# Altium project DW3120.PrjPcb
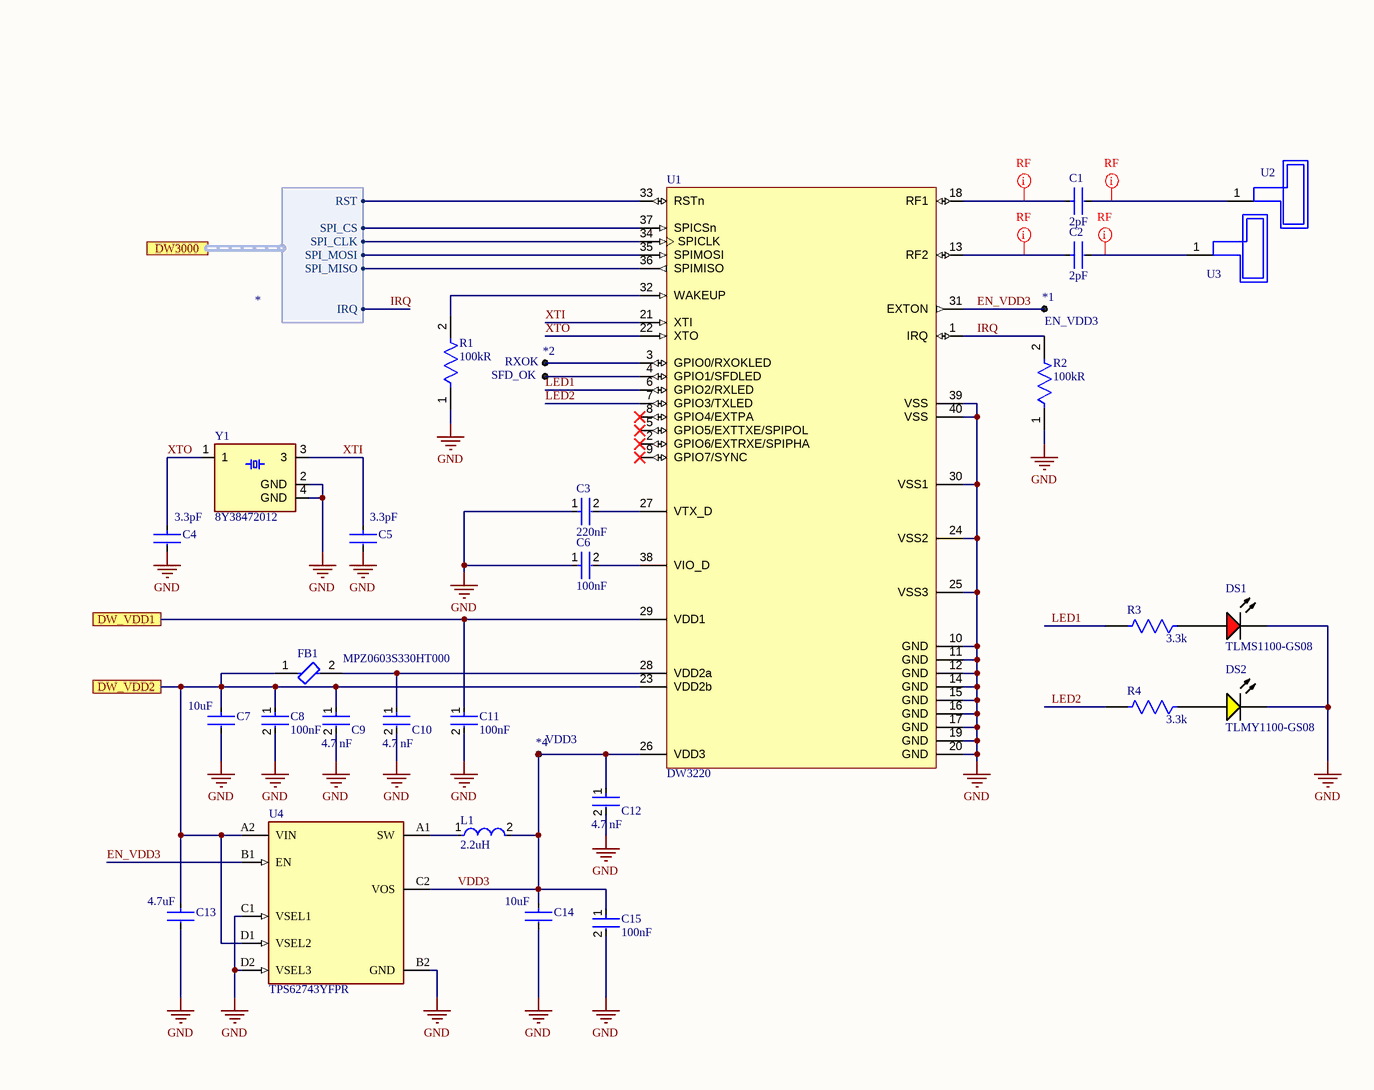
[diagram p0: DW3000.SchDoc]
2 sheets, 56 parts. Net scope: flat (ports and power ports of the same name join across sheets).
Board files: Deck.PcbDoc, PCB1_Layout_Final.PcbDoc
Sheets:
  DW3000.SchDoc
  Deck.SchDoc

## Sheet DW3000.SchDoc
size 254 x 203 mm

### Parts
*1  EN_VDD3  [Pad-0.6mm]  (no BOM)
*2  RXOK  [Pad-1mm]  (no BOM)
*3  SFD_OK  [Pad-1mm]  (no BOM)
*4  VDD3  [Pad-0.6mm]  (no BOM)
C1  Capacitance: 2pF  [FP-GJM033-0_03-IPC_B]  (hidden comment: GJM0335C1E2R0WB01D)
C2  Capacitance: 2pF  [FP-GJM033-0_03-IPC_B]  (hidden comment: GJM0335C1E2R0WB01D)
C3  Capacitance: 220nF  [FP-GRM155-0_05-IPC_C]  (hidden comment: GRM155R71C224KA12D)
C4  Capacitance: 3.3pF  [FP-GJM155-0_05-IPC_C]  (hidden comment: GJM1555C1H3R3BB01D)
C5  Capacitance: 3.3pF  [FP-GJM155-0_05-IPC_C]  (hidden comment: GJM1555C1H3R3BB01D)
C6  Capacitance: 100nF  [FP-GRM155-0_05-IPC_B]  (hidden comment: GRM155R71E104ME14D)
C7  Capacitance: 10uF  [FP-GRM155-0_2-0_1-IPC_C]  (hidden comment: GRM155R60J106ME47D)
C8  Capacitance: 100nF  [FP-GRM155-0_05-IPC_B]  (hidden comment: GRM155R71E104ME14D)
C9  Parameter 1: 4.7 nF  [FP-GRM155-0_15-IPC_B]  (hidden comment: GRM1555C1H472GE01D)
C10  Parameter 1: 4.7 nF  [FP-GRM155-0_15-IPC_B]  (hidden comment: GRM1555C1H472GE01D)
C11  Capacitance: 100nF  [FP-GRM155-0_05-IPC_B]  (hidden comment: GRM155R71E104ME14D)
C12  Parameter 1: 4.7 nF  [FP-GRM155-0_15-IPC_B]  (hidden comment: GRM1555C1H472GE01D)
C13  Capacitance: 4.7uF  [FP-GRM155-0_15-IPC_B]  (hidden comment: GRM155C80J475MEAAD)
C14  Capacitance: 10uF  [FP-GRM155-0_2-0_1-IPC_C]  (hidden comment: GRM155R60J106ME47D)
C15  Capacitance: 100nF  [FP-GRM155-0_05-IPC_B]  (hidden comment: GRM155R71E104ME14D)
DS1  TLMS1100-GS08  [VISH-TLMX1100_V]
DS2  TLMY1100-GS08  [VISH-TLMX1100-2_V]
FB1  MPZ0603S330HT000  [FP-MPZ0603-IPC_B]
L1  Inductance: 2.2uH  [FP-DFE201610C-IPC_C]  (hidden comment: 1285AS-H-2R2M=P2)
R1  Resistance: 100kR  [FP-CRCW0402-e3-IPC_C]  (hidden comment: CRCW0402100KFKED)
R2  Resistance: 100kR  [FP-CRCW0402-e3-IPC_C]  (hidden comment: CRCW0402100KFKED)
R3  Resistance: 3.3k  [FP-CRCW0402-e3-IPC_C]
R4  Resistance: 3.3k  [FP-CRCW0402-e3-IPC_C]
U1  DW3220  [QFN40P500X500X40_HS-40N]
U2  AH086M555003-T  [AH086M]  (value not drawn)
U3  AH086M555003-T  [AH086M]  (value not drawn)
U4  TPS62743YFPR  [FP-YFP0008-C01-MFG]
Y1  8Y38472012  [OSCSC320X250X100N]

### Ports
DW3000 (harness *), DW_VDD1, DW_VDD2

### Harnesses
*: SPI_CS, SPI_CLK, SPI_MOSI, SPI_MISO, RST, IRQ

### Nets
GND: C3.1 C4.2 C5.2 C6.1 C7.2 C8.2 C9.2 C10.2 C11.2 C12.2 C13.2 C14.2 C15.2 DS1.2(K) DS2.2(K) R1.1 R2.1 U1.10(GND) U1.11(GND) U1.12(GND) U1.14(GND) U1.15(GND) U1.16(GND) U1.17(GND) U1.19(GND) U1.20(GND) U1.24(VSS2) U1.25(VSS3) U1.30(VSS1) U1.39(VSS) U1.40(VSS) U4.B2(GND) U4.C1(VSEL1) U4.D2(VSEL3) Y1.2(GND) Y1.4(GND)
CS: U1.37(SPICSn) ; port DW3000.SPI_CS
EN_VDD3: *1.1 U1.31(EXTON) U4.B1(EN)
IRQ: R2.2 U1.1(IRQ) ; port DW3000.IRQ
LED1: R3.2 U1.6(GPIO2/RXLED)
LED2: R4.2 U1.7(GPIO3/TXLED)
MISO: U1.36(SPIMISO) ; port DW3000.SPI_MISO
MOSI: U1.35(SPIMOSI) ; port DW3000.SPI_MOSI
RESET: U1.33(RSTn) ; port DW3000.RST
SCK: U1.34(SPICLK) ; port DW3000.SPI_CLK
VDD3: *4.1 C12.1 C14.1 C15.1 L1.2 U1.26(VDD3) U4.C2(VOS)
XTI: C5.1 U1.21(XTI) Y1.3
XTO: C4.1 U1.22(XTO) Y1.1
Net*2_1: *2.1 U1.3(GPIO0/RXOKLED)
Net*3_1: *3.1 U1.4(GPIO1/SFDLED)
NetC1_1: C1.1 U1.18(RF1)
NetC1_2: C1.2 U2.1
NetC2_1: C2.1 U1.13(RF2)
NetC2_2: C2.2 U3.1
NetC3_2: C3.2 U1.27(VTX_D)
NetC6_2: C6.2 U1.38(VIO_D)
NetC7_1: C7.1 C8.1 C9.1 C13.1 FB1.1 U1.23(VDD2b) U4.A2(VIN) U4.D1(VSEL2) ; port DW_VDD2
NetC10_1: C10.1 FB1.2 U1.28(VDD2a)
NetC11_1: C11.1 U1.29(VDD1) ; port DW_VDD1
NetDS1_1: DS1.1(A) R3.1
NetDS2_1: DS2.1(A) R4.1
NetL1_1: L1.1 U4.A1(SW)
NetR1_2: R1.2 U1.32(WAKEUP)

Not connected (* = marked no-connect by the designer): U1 2(GPIO6/EXTRXE/SPIPHA)* 5(GPIO5/EXTTXE/SPIPOL)* 8(GPIO4/EXTPA)* 9(GPIO7/SYNC)*

### Layout directives
net class RF: NetC1_1, NetC1_2, NetC2_1, NetC2_2

### Notes on the sheet
- 1
- 2
- 3
- 4
- A
- B
- C
- Project:
- D
- Date:
- Drawing number:
- Rev:
- Format:
- A4 Q
- Drawn by:
- Laboratory:
- Page
- Sheet:
- of
- File:

### Library data of the parts
*1 *4 = CMP-00224-1: 0.6mm SMT Test Pad; Mounting Technology: SMT
*2 *3 = CMP-01283-1: 1mm SMT Test Pad; Mounting Technology: SMT
C1 C2 = CMP-2010-00751-2: Ceramic Capacitor 2pF ±0.05pF 25V C0G 0201 (0603 Metric); Package Quantity: 15000; Min Operating Temperature: -55°C; Thickness: 0.013inch; Max Operating Temperature: 125°C; Voltage Rating: 25V; Voltage Rating (DC): 25V; Packaging: Tape and Reel; Width: 0.012inch; Length: 0.6mm; Height: 0.3mm; Mount: Surface Mount; Case Code (Imperial): 0201; Radiation Hardening: No; Dielectric: C0G; Termination: SMD/SMT; Case Code (Metric): 0603; Case/Package: 0201; Depth: 0.3mm
C3 = CMP-1034-02089-3: Chip Multilayer Ceramic Capacitors for General Purpose, 0402, 0.22uF, X7R, 15%, 10%, 16V; Depth: 0.5mm; Dielectric: X7R; Min Operating Temperature: -55°C; Package Quantity: 1; Termination: SMD/SMT; Mount: Surface Mount; Radiation Hardening: No; Height: 0.5mm; Case Code (Metric): 1005; Packaging: Tape and Reel; Material: Ceramic; Voltage: 16V; Voltage Rating (DC): 16V; REACH SVHC: No SVHC; Voltage Rating: 16V; Length: 1mm; Tolerance: 10%; Thickness: 0.022inch; Case Code (Imperial): 0402; Max Operating Temperature: 125°C; Width: 0.02inch; Lead Free: Lead Free; Case/Package: 0402
C4 C5 = CMP-2008-03846-2: Multi-Layer Ceramic Capacitor 3.3pF C0G  ±0.1pF 0402 Paper T/R; Voltage: 50V; Lead Free: Lead Free; Thickness: 0.022inch; Mount: Surface Mount; Termination: SMD/SMT; Package Quantity: 1; Lead Pitch: 0.3mm; Case/Package: 0402; REACH SVHC: No SVHC; Case Code (Imperial): 0402; Number of Pins: 2; Height: 0.5mm; Width: 0.5mm; Depth: 0.5mm; Packaging: Tape and Reel; Min Operating Temperature: -55°C; Length: 1mm; Dielectric: C0G; Case Code (Metric): 1005; Max Operating Temperature: 125°C; Voltage Rating (DC): 50V; Voltage Rating: 50V; Radiation Hardening: No
C6 C8 C11 C15 = CMP-06035-053616-1: Chip Multilayer Ceramic Capacitors for General Purpose, 0402, 0.10uF, X7R, 15%, 20%, 25V; Dielectric: X7R; Width: 0.5mm; Case/Package: 0402; Package Quantity: 10000; Lead Free: Lead Free; Voltage Rating (DC): 25V; Max Operating Temperature: 125°C; Depth: 0.5mm; Packaging: Tape and Reel; Length: 1mm; Case Code (Metric): 1005; Tolerance: 20%; Case Code (Imperial): 0402; Thickness: 0.022inch; Material: Ceramic; Voltage Rating: 25V; Weight: 0.000212oz; Min Operating Temperature: -55°C; Termination: SMD/SMT; Mount: Surface Mount; Resistor Type: Ceramic; Height: 0.5mm
C7 C14 = CMP-06035-022355-1: Chip Multilayer Ceramic Capacitors for General Purpose, 0402, 10uF, X5R, 15%, 20%, 6.3V; Mount: Surface Mount; Tolerance: 20%; Width: 0.02inch; Voltage Rating: 6.3V; Length: 0.039inch; Case Code (Imperial): 0402; Voltage Rating (DC): 6.3V; Max Operating Temperature: 85°C; Thickness: 0.024inch; Min Operating Temperature: -55°C; Packaging: Tape and Reel; Case/Package: 0402; Dielectric: X5R; Case Code (Metric): 1005
C9 C10 C12 = CMP-06035-019672-1: Chip Multilayer Ceramic Capacitors for General Purpose, 0402, 4700pF, C0G, 30ppm/°C, 2%, 50V
C13 = CMP-06035-032730-1: Chip Multilayer Ceramic Capacitors for General Purpose, 0402, 4.7uF, X6S, 22%, 20%, 6.3V; Dielectric: X6S; Length: 1mm; Tolerance: 20%; Voltage Rating (DC): 6.3V; Width: 500um; Thickness: 500um
DS1 = CMP-1666-00027-1: LED, RED, 2.1 V, -40 to 100 degC, 2-Pin SMD (0603), RoHS, Tape and Reel; Type (Capacitors): C0G; Resistance: 100000000000 Ohm; Capacitance: 12 pF; Voltage Rating: 50 V; Tolerance: 5%; Min Operating Temperature: -55degC; REACH SVHC: No SVHC; ComponentLink2Description: Datasheet; ComponentLink1URL: http://www.vishay.com/; Width: 0.8 mm; Package Quantity: 4000; PackageReference: TLMX1100; ComponentLink2URL: http://www.vishay.com/docs/83173/tlmb1100.pdf; Case/Package: 0603; Case Code (Metric): 1608; Packaging: Tape and Reel; Pins: 2; ComponentLink1Description: Manufacturer URL; Max Operating Temperature: 125degC; Height: 0.8 mm; Length: 1.6 mm; Mount: Surface Mount; PackageDescription: 2-Pin Surface Mount Device, Body 1.6 x 0.8 mm; DatasheetVersion: Rev. 2.7, 03/2016; Case Code (Imperial): 0603; Voltage Rating (DC): 50 V; RoHSCompliant: True; Radiation Hardening: No
DS2 = CMP-1666-00030-1: Yellow LED, 20 mA, 2.1 V, -40 to 100 degC, 2-Pin SMD (0603), RoHS, Tape and Reel; ComponentLink2Description: Datasheet; ComponentLink2URL: http://download.siliconexpert.com/pdfs/2016/8/7/12/43/26/667/vsh_/manual/379263299541529tlmb1100.pdf; ComponentLink1Description: Manufacturer URL; PackageDescription: 2-Pin Surface Mount Device, Body 1.6 x 0.8 mm; DatasheetVersion: Rev. 2.7, 03/2016; ComponentLink1URL: http://www.vishay.com/; PackageReference: 0603
FB1 = CMP-08257-000038-1: CHIP BEADS FOR GENERAL SIGNAL LI; Number of Lines: 1; Max Current Rating: 1.6A; DC Resistance (DCR): 50mR; Case/Package: 0201; Min Operating Temperature: -55°C; Max Operating Temperature: 125°C; Mount: Surface Mount; RoHS Compliant: Yes; Packaging: Cut Tape; Case Code (Metric): 0603; Case Code (Imperial): 0201
L1 = CMP-06042-000201-1: Shielded Wirewound Inductor 2.2uH 20% 1200mA 0.204Ω 0806 (2016); DC Resistance (DCR): 204mR; Current Rating: 1.5A; Core Material: Ferrite; Max DC Current: 1.2A; Test Frequency: 1MHz; Height - Seated (Max): 0.039inch; Min Operating Temperature: -40°C; Width: 0.063inch; Packaging: Tape and Reel; Case Code (Imperial): 0805; Mount: Surface Mount; Shielding: Shielded; Resistor Type: Wirewound; Case Code (Metric): 2012; Max Operating Temperature: 85°C; Depth: 1.6mm; Case/Package: 0805; Length: 0.079inch; Tolerance: 20%
R1 R2 = CMP-2002-08123-3: RES Thick Film, 100kΩ, 1%, 0.063W, 100ppm/°C, 0402; Power Rating: 63mW; Voltage Rating (DC): 50V; Lead Free: Lead Free; Height: 0.35mm; Contact Plating: Tin; Min Operating Temperature: -55°C; Package Quantity: 10000; Case/Package: 0402; Temperature Coefficient: 100ppm/°C; Number of Terminations: 2; Packaging: Tape and Reel; Max Power Dissipation: 63mW; Case Code (Metric): 1005; Mount: Surface Mount; Width: 0.02inch; Termination: SMD/SMT; Length: 1mm; Number of Pins: 2; Weight: 2.3E-05oz; Radiation Hardening: No; Tolerance: 1%; Military Standard: Not; Features: Automotive AEC-Q200; Depth: 0.5mm; Composition: Thick Film; Max Operating Temperature: 155°C; Voltage Rating: 50V; Case Code (Imperial): 0402
R3 R4 = CMP-2002-08123-3: RES Thick Film, 3.3kΩ, 1%, 0.063W, 100ppm/°C, 0402; Power Rating: 63mW; Voltage Rating (DC): 50V; Lead Free: Lead Free; Height: 0.35mm; Contact Plating: Tin; Min Operating Temperature: -55°C; Package Quantity: 10000; Case/Package: 0402; Temperature Coefficient: 100ppm/°C; Number of Terminations: 2; Packaging: Tape and Reel; Max Power Dissipation: 63mW; Case Code (Metric): 1005; Mount: Surface Mount; Width: 0.02inch; Termination: SMD/SMT; Length: 1mm; Number of Pins: 2; Weight: 2.3E-05oz; Radiation Hardening: No; Tolerance: 1%; Military Standard: Not; Features: Automotive AEC-Q200; Depth: 0.5mm; Composition: Thick Film; Max Operating Temperature: 155°C; Voltage Rating: 50V; Case Code (Imperial): 0402
U1 = CMP-01416-1: Ultra-low power Wi-Fi 802.11b/g/n, without mounted antenna; Manufacturer: Qorvo; Part # Aliases: DWM3000; Interface: SPI; MCU: External; Antenna Ports(#): 2; Data Rate: 850 kbps, 6.8 Mbps; 802.15 Standards: 4a, 4z-BPRF; Package(mm): 5 x 5; PDoA Support: Yes; Ranging Accuracy(cm): < 10; Security Features: 4z Compliant + AES; Voltage(V): 2.4 to 3.6; Angle of Arrival(degrees): < 5; UWB Channels: 5, 9; BOM Ext Components(#): 10; Product Type: RF Transceiver; Series: DWM3000; Package Type: QFN; Subcategory: Wireless & RF Integrated Circuits
U2 U3 = CMP-00997-1: 3.5GHz, 5.6GHz WiMax™ Chip RF Antenna 3.1GHz ~ 8GHz 2.6dBi, 0.7dBi Solder Surface Mount; Frequency: 5.55GHz; Impedance: 50R; Number of Bands: 1; Mount: Surface Mount; Min Operating Temperature: -20°C; Max Operating Temperature: 80°C; Packaging: Tape and Reel; Package Quantity: 1; Termination: Solder; Max Frequency: 8GHz; Length: 8mm; Height: 0.039inch; Width: 6mm; Radiation Hardening: No; REACH SVHC: Unknown
U4 = CMP-04918-000507-1: IC REG BUCK PROG 300MA 8DSBGA; Output Configuration: Positive; Switching Frequency: 1.2MHz; Number of Outputs: 1; Min Input Voltage: 2.15V; Min Output Voltage: 1.2V; Max Input Voltage: 5.5V; Synchronous Rectifier: Yes; Max Output Voltage: 3.3V; Quiescent Current: 300nA; Max Operating Temperature: 85°C; Lead Free: Lead Free; Min Operating Temperature: -40°C; Packaging: Tape and Reel; RoHS Compliant: Yes; Mount: Surface Mount; Output Current: 300mA
Y1 = ABM8G-14.31818MHZ-B4Y-T: Crystal 38.4MHz ±10ppm (Stability) 10pF FUND 80Ohm 4-Pin Mini-CSMD T/R; Package: None; Price: None; Value: 38.4 MHz; MP: 8Y38472012; Availability: Unavailable; ComponentLink1Description: Digikey; ComponentLink1URL: https://www.digikey.ch/en/products/detail/txc-corporation/8Y38472012/10492155

## Sheet Deck.SchDoc: TOF_Deck
size A4; Author: Iman Ostovar; CompanyName: ETH Zürich; DrawnBy: Iman Ostovar; Engineer: Iman Ostovar; Organization: PBL; DocumentNumber: Master Project; Revision: A; SheetNumber: 1; SheetTotal: 1
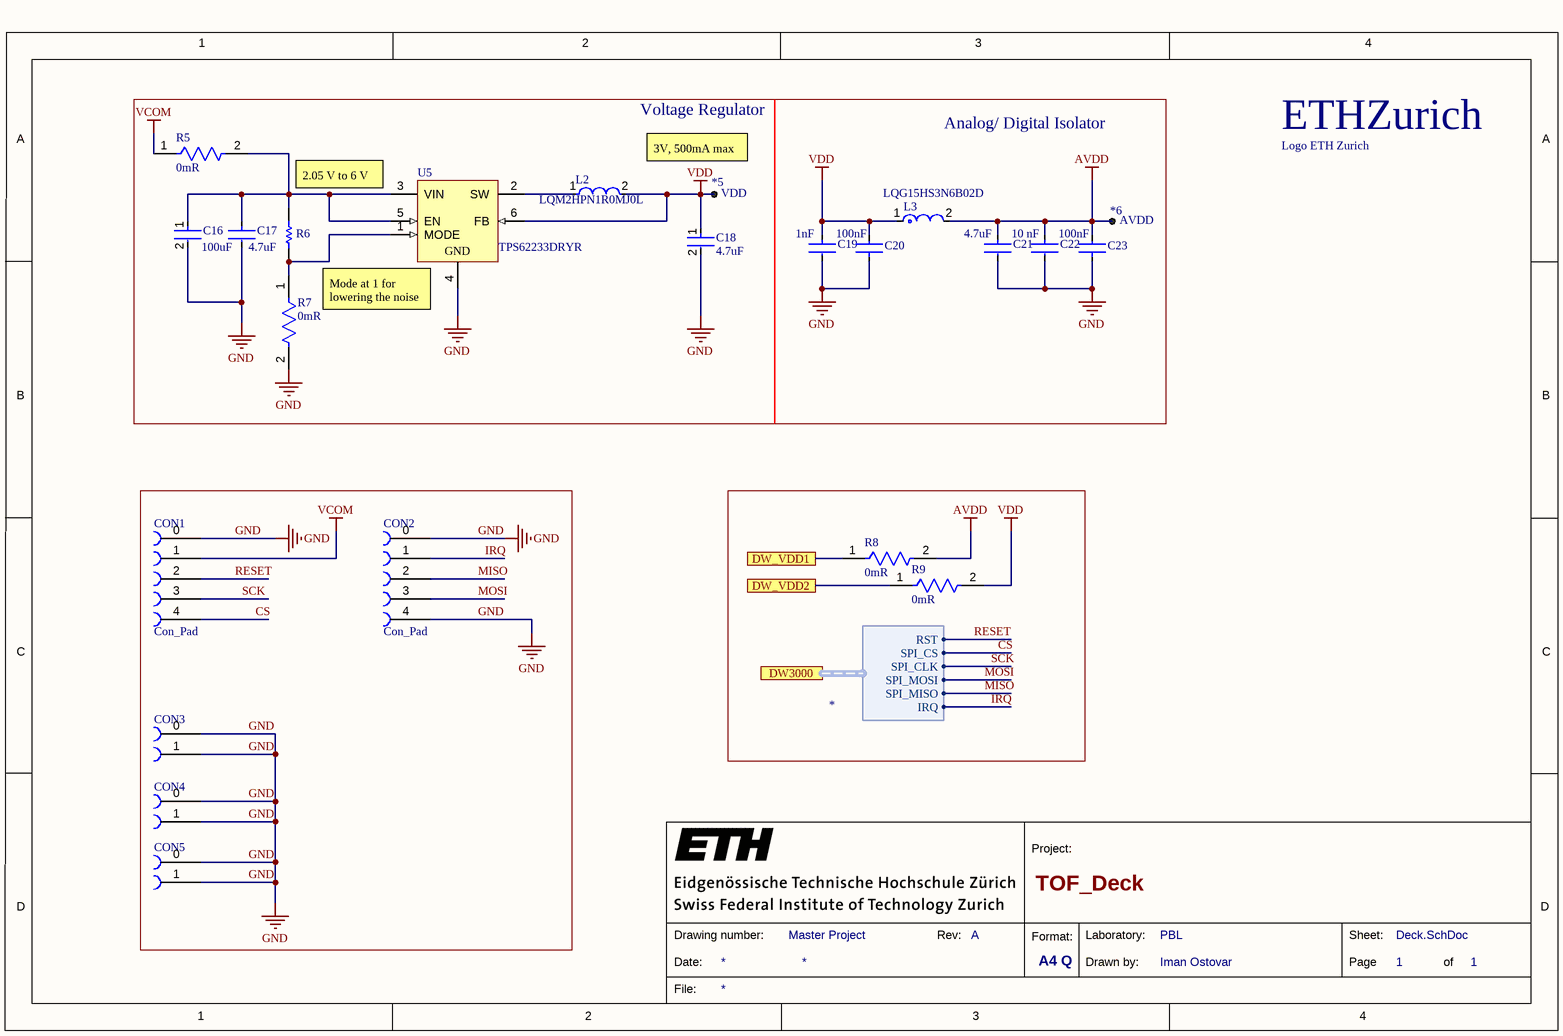
[diagram p1: Deck.SchDoc]

### Parts
*5  VDD  [Pad-1mm]  (no BOM)
*6  AVDD  [Pad-1mm]  (no BOM)
A1  Logo ETH Zurich  [eth-zurich_3mm]  (no BOM)
C16  Capacitance: 100uF  [FP-GRM21B-0_2-e0_2_0_7-IPC_A]  (hidden comment: GRM21BR60J107ME15L)
C17  Capacitance: 4.7uF  [FP-GRM155-0_1-IPC_B]  (hidden comment: GRM155R60J475ME47D)
C18  Capacitance: 4.7uF  [FP-GRM155-0_1-IPC_B]  (hidden comment: GRM155R60J475ME47D)
C19  Capacitance: 1nF  [FP-GRM155-0_05-IPC_B]  (hidden comment: GRM1555C1H102JA01D)
C20  Capacitance: 100nF  [FP-GRM155-0_05-IPC_B]  (hidden comment: GRM155R71E104ME14D)
C21  Capacitance: 4.7uF  [FP-GRM155-0_1-IPC_B]  (hidden comment: GRM155R60J475ME47D)
C22  Capacitance: 10 nF  [FP-CC0402-MFG]  (hidden comment: CC0402KRX7R7BB103)
C23  Capacitance: 100nF  [FP-GRM155-0_05-IPC_B]  (hidden comment: GRM155R71E104ME14D)
CON1  Con_Pad  [Cons_Pad]
CON2  Con_Pad  [Cons_Pad]
CON3  Con_Pad_GND  [PCBComponent_1]  (value not drawn)
CON4  Con_Pad_GND  [PCBComponent_1]  (value not drawn)
CON5  Con_Pad_GND  [PCBComponent_1]  (value not drawn)
L2  LQM2HPN1R0MJ0L  [FP-LQM2HPN_J0-IPC_B]
L3  LQG15HS3N6B02D  [FP-LQG15HH_02-IPC_A]
R5  Resistance: 0mR  [FP-CRCW0402-e3-IPC_C]  (hidden comment: CRCW04020000Z0ED)
R6  CPF0402B47K5E1  [RESC1005X35X20LL05T10]  (value not drawn)
R7  Resistance: 0mR  [FP-CRCW0402-e3-IPC_C]  (hidden comment: CRCW04020000Z0ED)
R8  Resistance: 0mR  [FP-CRCW0402-e3-IPC_C]  (hidden comment: CRCW04020000Z0ED)
R9  Resistance: 0mR  [FP-CRCW0402-e3-IPC_C]  (hidden comment: CRCW04020000Z0ED)
U5  TPS62233DRYR  [DRY0006A]

### Ports
DW3000 (harness *), DW_VDD1, DW_VDD2

### Harnesses
*: SPI_CS, SPI_CLK, SPI_MOSI, SPI_MISO, RST, IRQ

### Nets
AVDD: *6.1 C21.1 C22.1 C23.2 L3.2 R8.2
GND: C16.2 C17.2 C18.2 C19.2 C20.1 C21.2 C22.2 C23.1 CON1.0 CON2.0 CON2.4 CON3.0 CON3.1 CON4.0 CON4.1 CON5.0 CON5.1 R7.2 U5.4(GND)
VCOM: CON1.1 R5.1
VDD: *5.1 C18.1 C19.1 C20.2 L2.2 L3.1 R9.2 U5.6(FB)
CS: CON1.4 ; port DW3000.SPI_CS
IRQ: CON2.1 ; port DW3000.IRQ
MISO: CON2.2 ; port DW3000.SPI_MISO
MOSI: CON2.3 ; port DW3000.SPI_MOSI
RESET: CON1.2 ; port DW3000.RST
SCK: CON1.3 ; port DW3000.SPI_CLK
NetC7_1: R9.1 ; port DW_VDD2
NetC11_1: R8.1 ; port DW_VDD1
NetC16_1: C16.1 C17.1 R5.2 R6.2 U5.3(VIN) U5.5(EN)
NetL2_1: L2.1 U5.2(SW)
NetR6_1: R6.1 R7.1 U5.1(MODE)

### Notes on the sheet
- Voltage Regulator
- 3V, 500mA max
- Analog/ Digital Isolator
- 2.05 V to 6 V
- (near U5) Mode at 1 for lowering the noise
- 1
- 2
- 3
- 4
- A
- B
- C
- Project:
- D
- Date:
- Drawing number:
- Rev:
- Format:
- A4 Q
- Drawn by:
- Laboratory:
- Page
- Sheet:
- of
- File:
- (in symbol CMP-00038-1) ETHZurich

### Library data of the parts
*5 *6 = CMP-01283-1: 1mm SMT Test Pad; Mounting Technology: SMT
A1 = CMP-00038-1
C16 = CMP-2000-07599-2: Chip Multilayer Ceramic Capacitors for General Purpose, 0805, 100uF, X5R, 15%, 20%, 6.3V; Length: 0.079inch; Dielectric: X5R; Case Code (Metric): 2012; Max Operating Temperature: 85°C; Voltage Rating (DC): 6.3V; Min Operating Temperature: -55°C; Tolerance: 20%; Packaging: Cut Tape; Voltage Rating: 6.3V; REACH SVHC: No SVHC; Width: 0.049inch; Mount: Surface Mount; Case/Package: 0805; Case Code (Imperial): 0805; Lead Free: Lead Free; Thickness: 0.057inch
C17 C18 C21 = CMP-2008-04549-2: Chip Multilayer Ceramic Capacitors for General Purpose, 0402, 4.7uF, X5R, 15%, 20%, 6.3V; Height: 0.5mm; Weight: 0.000212oz; Length: 1mm; Case Code (Metric): 1005; Packaging: Tape and Reel; Termination: SMD/SMT; Dielectric: X5R; Depth: 0.5mm; Case Code (Imperial): 0402; Min Operating Temperature: -55°C; Case/Package: 0402; Voltage: 6.3V; Width: 0.02inch; Lead Free: Lead Free; Thickness: 0.022inch; Contact Plating: Tin; REACH SVHC: No SVHC; Package Quantity: 10000; Tolerance: 20%; Voltage Rating (DC): 6.3V; Voltage Rating: 6.3V; Mount: Surface Mount; Max Operating Temperature: 85°C
C19 = CMP-2008-04254-2: Chip Multilayer Ceramic Capacitors for General Purpose, 0402, 1000pF, C0G, 30ppm/°C, 5%, 50V; Insulation Resistance: 10GR; Packaging: Tape and Reel; Lead Free: Lead Free; Tolerance: 5%; Temperature Coefficient: 30ppm/°C; Thickness: 0.022inch; Termination: SMD/SMT; Max Operating Temperature: 125°C; Height: 0.5mm; Package Quantity: 1; Radiation Hardening: No; Material: Ceramic; Case Code (Metric): 1005; Number of Pins: 2; Voltage Rating: 50V; Mount: Surface Mount; Voltage: 50V; Case/Package: 0402; Min Operating Temperature: -55°C; Dielectric Material: Ceramic; Width: 0.5mm; Depth: 0.5mm; Case Code (Imperial): 0402; REACH SVHC: No SVHC; Dielectric: C0G; Voltage Rating (DC): 50V; Length: 1mm
C20 C23 = CMP-06035-053616-1: as C6 on sheet DW3000; Dielectric: X7R; Width: 0.5mm; Case/Package: 0402; Package Quantity: 10000; Lead Free: Lead Free; Voltage Rating (DC): 25V; Max Operating Temperature: 125°C; Depth: 0.5mm; Packaging: Tape and Reel; Length: 1mm; Case Code (Metric): 1005; Tolerance: 20%; Case Code (Imperial): 0402; Thickness: 0.022inch; Material: Ceramic; Voltage Rating: 25V; Weight: 0.000212oz; Min Operating Temperature: -55°C; Termination: SMD/SMT; Mount: Surface Mount; Resistor Type: Ceramic; Height: 0.5mm
C22 = CMP-03422-000501-1: CAP CER 10000PF 16V X7R 0402; Manufacturer: YAGEO; Automotive Grade: NA; Material: Ceramic; Value: 10 nF; Tolerance: 0.1; Temperature Coefficient: 30ppm/°C; Temperature Range Low: -55°C; Temperature Range High: +125°C; Mouser Description: 0402 10 nF 16 V ±10 % Tolerance X7R SMT Multilayer Ceramic Capacitor; Footprint Url: http://www.yageo.com/exep/pages/download/literatures/UPY-C_GEN_24.pdf; Category: Cap; RoHS: TRUE; Manufacturer Part Number: CC0402KRX7R7BB103; ComponentLink2Description: Datasheet; Ipc Land Pattern Name: CAPC10050X50; Automotive: No; ComponentLink2URL: http://www.yageo.com/documents/recent/UPY-GP_NP0_16V-to-50V_16.pdf; Device Class L1: Passive Components; Height: 0.55mm; Temperature Characteristic: X7R; Package: CC0402; Voltage Rating: 16 V; Device Class L3: Ceramic Capacitors; Lead Free: Yes; Device Class L2: Capacitors; Digikey Description: CAP CER 10000PF 16V X7R 0402; Octopart: https://octopart.com/cc0402krx7r7bb103-yageo-192895; Temperature: -55°C to +125°C
L2 = CMP-1662-00025-2: FIXED IND 1UH 1.5A 90 MOHM SMD; Shielding: Shielded; Self Resonant Frequency: 70MHz; Tolerance: 20%; DC Resistance (DCR): 3.5R; Current: 150mA; Core Material: Ferrite; Test Frequency: 1MHz; Inductance: 1uH; Package Quantity: 3000; Military Standard: Not; Height: 1.1mm; Min Operating Temperature: -40°C; RoHS Compliant: Yes; Case/Package: 1008; Depth: 2.2mm; Mount: Surface Mount; REACH SVHC: No SVHC; Max DC Current: 1.5A; Max Operating Temperature: 125°C; Case Code (Metric): 2520; Series: LQM2HP_J0; Inductance Tolerance: 20%; Length: 2.5mm; DC Current: 1.5A; Radiation Hardening: No; Lead Free: Lead Free; Case Code (Imperial): 1008; Width: 2mm; Current Rating: 1.5A; Packaging: Tape and Reel; Termination: SMD/SMT
L3 = CMP-06042-005542-1: Multilayer type RF Inductor 3.6nH ±0.1nH 0.14Ω 750mA 0402
R5 R7-R9 = CMP-2002-08122-2: RES Thick Film, 0Ω, 0.063W, 0402; Tolerance: 5%; Max Power Dissipation: 63mW; Voltage Rating: 50V; Temperature Coefficient: 100ppm/°C; Contact Plating: Tin; Height: 0.35mm; Radiation Hardening: No; Features: Automotive AEC-Q200; Composition: Thick Film; Width: 0.5mm; Weight: 2.3E-05oz; Termination: SMD/SMT; Packaging: Tape and Reel; Mount: Surface Mount; Case Code (Metric): 1005; Military Standard: Not; Min Operating Temperature: -55°C; Number of Terminations: 2; Package Quantity: 1; Case Code (Imperial): 0402; Depth: 0.5mm; Max Operating Temperature: 155°C; Case/Package: 0402; Power Rating: 63mW; Lead Free: Lead Free; Voltage Rating (DC): 50V; Length: 1mm
R6 = CMP-2002-03309-1: 47.5k, CPF0402B47K5E1; Manufacturer: TE Connectivity / AMP; Part Number: CPF0402B47K5E1
U5 = CMP-0323-00281-3: Buck Step Down Regulator with 2.05 to 6 V Input and 3 V Output, -40 to 85 degC, 6-Pin SON (DRY), Green (RoHS & no Sb/Br); Manufacturer: Texas Instruments; Vin(Max)(V): 6; Synchronous Rectification: False; Regulated Outputs(#): 1; SubFamily: Step-Down Regulator; Rating: Catalog; Preset Vout(V): 3; Vin(Min)(V): 2.05; Iq(Typ)(mA): 0.022; Duty Cycle(Max)(%): 100; Switch Current Limit(Typ)(A): 0.84; Iout(Max)(A): 0.5; ComponentLink1URL: http://www.ti.com/general/docs/lit/getliterature.tsp?genericPartNumber=TPS62233&fileType=pdf; Eco-Plan: Green (RoHS & no Sb/Br); ComponentLink1Description: Datasheet; PackageDescription: 6-Pin Plastic Small Outline No-Lead, 1 x 1.45 x 0.6 mm Body, 0.5 mm Pitch; PartNumber: TPS62233DRYR; Topology: Buck; Vout(Min)(V): 3; ComponentLink2Description: Package Specification; DatasheetVersion: SLVS941E; ComponentLink3URL: Samples URL:http://www.ti.com/product/tps62233#samples; Vout(Max)(V): 3; ComponentLink2URL: http://www.ti.com/litv/pdf/mpds221e; PackageVersion: revF, Dec-2011; ComponentLink3Description: URL Link1; PackageReference: DRY0006A; Mounting Technology: Surface Mount

## Nets that join several sheets
GND: DW3000 (36 pins), Deck (19 pins)
CS: DW3000 (U1.37), Deck (CON1.4)
IRQ: DW3000 (R2.2 U1.1), Deck (CON2.1)
MISO: DW3000 (U1.36), Deck (CON2.2)
MOSI: DW3000 (U1.35), Deck (CON2.3)
NetC7_1: DW3000 (8 pins), Deck (R9.1)
NetC11_1: DW3000 (C11.1 U1.29), Deck (R8.1)
RESET: DW3000 (U1.33), Deck (CON1.2)
SCK: DW3000 (U1.34), Deck (CON1.3)

## Assembly variants
Variant of DW3120: not fitted R7